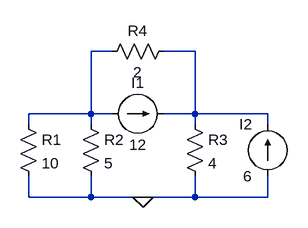
[diagram p0: schematic Draft6.asc]
Draft6.asc, the LTspice schematic file:
Version 4
SHEET 1 880 680
WIRE 576 -16 544 -16
WIRE 704 -16 656 -16
WIRE 544 80 544 -16
WIRE 544 80 448 80
WIRE 576 80 544 80
WIRE 704 80 704 -16
WIRE 704 80 656 80
WIRE 816 80 704 80
WIRE 448 96 448 80
WIRE 544 96 544 80
WIRE 704 96 704 80
WIRE 816 96 816 80
WIRE 448 208 448 176
WIRE 544 208 544 176
WIRE 544 208 448 208
WIRE 624 208 544 208
WIRE 704 208 704 176
WIRE 704 208 624 208
WIRE 816 208 816 176
WIRE 816 208 704 208
FLAG 624 208 0
SYMBOL res 432 80 R0
SYMATTR InstName R1
SYMATTR Value 10
SYMBOL res 528 80 R0
SYMATTR InstName R2
SYMATTR Value 5
SYMBOL res 688 80 R0
SYMATTR InstName R3
SYMATTR Value 4
SYMBOL res 672 -32 R90
WINDOW 0 0 56 VBottom 2
WINDOW 3 32 56 VTop 2
SYMATTR InstName R4
SYMATTR Value 2
SYMBOL current 576 80 R270
WINDOW 0 32 40 VTop 2
WINDOW 3 -32 40 VBottom 2
SYMATTR InstName I1
SYMATTR Value 12
SYMBOL current 816 176 R180
WINDOW 0 24 80 Left 2
WINDOW 3 24 0 Left 2
SYMATTR InstName I2
SYMATTR Value 6

The netlist it stands for:
* Draft6.asc
R1 N001 0 10
R2 N001 0 5
R3 N002 0 4
R4 N002 N001 2
I1 N001 N002 12
I2 0 N002 6
.backanno
.end